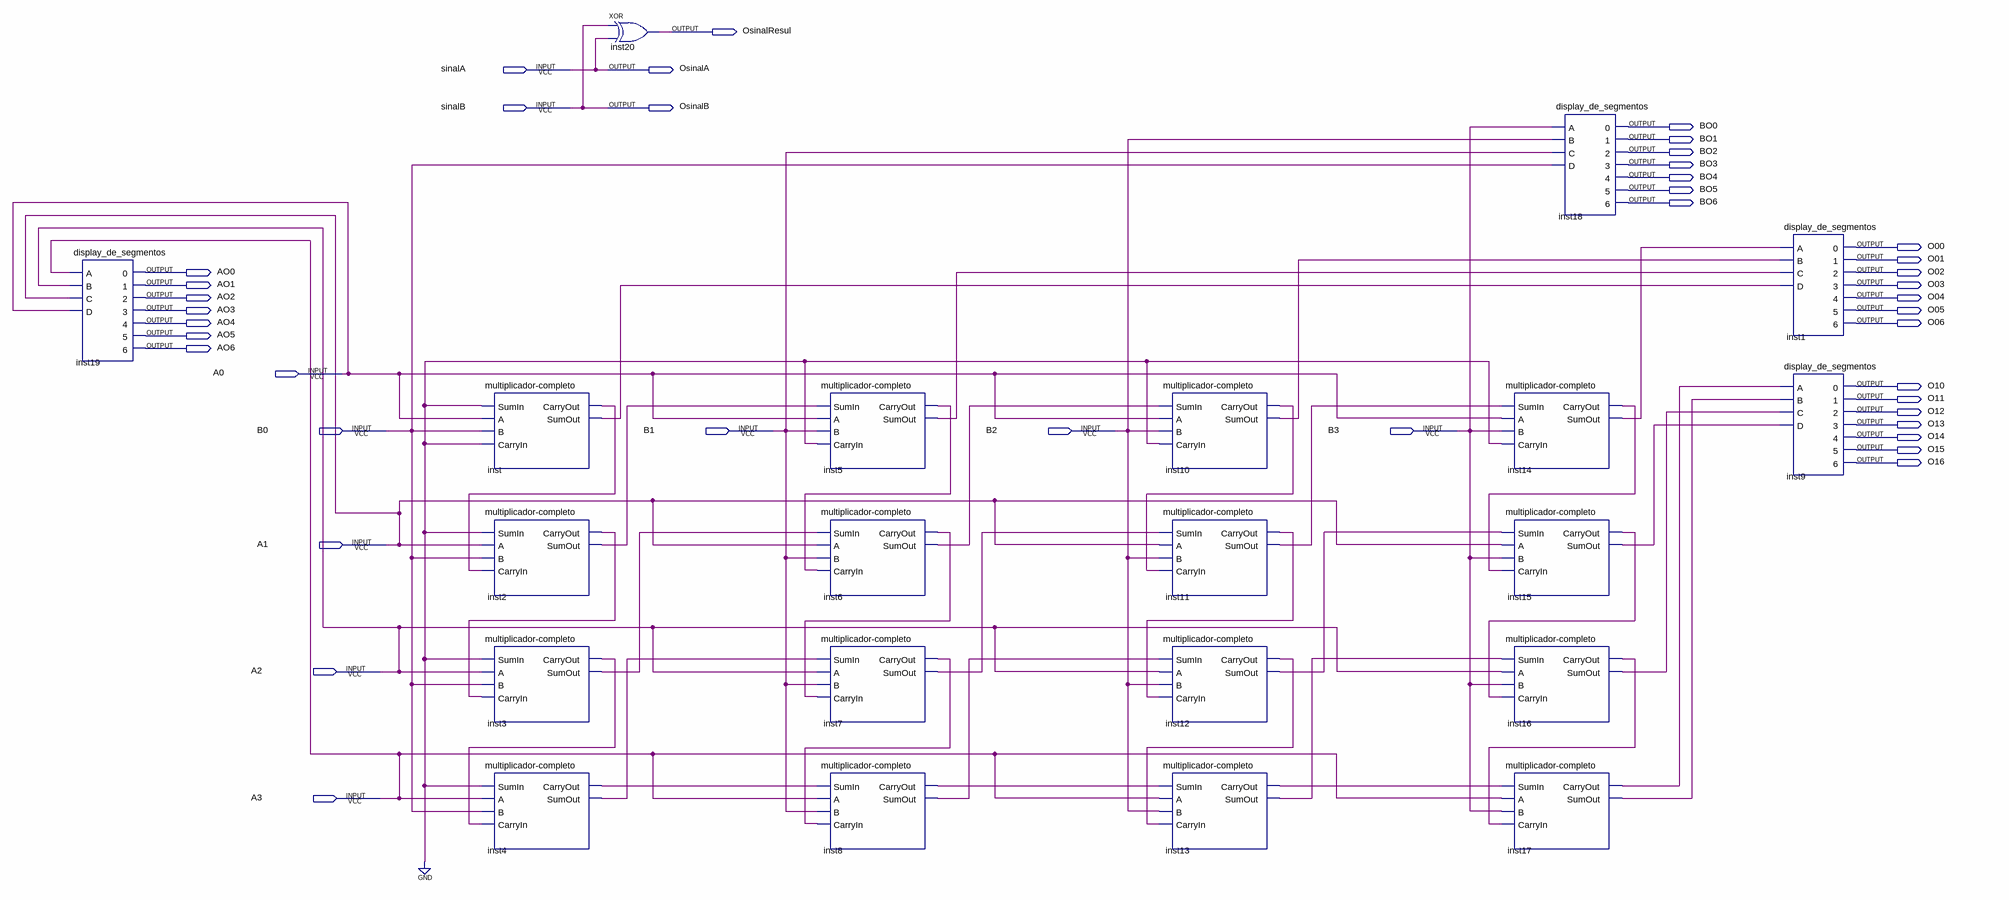
[diagram p0: schematic sheet]
// Quartus schematic multiplicador_4bits.bdf as structural Verilog: 21 symbols, 41 pins
module multiplicador_4bits (
  input  sinalA,
  input  sinalB,
  input  A0,
  input  B0,
  input  B1,
  input  B2,
  input  B3,
  input  A1,
  input  A2,
  input  A3,
  output OsinalResul,
  output OsinalA,
  output OsinalB,
  output BO0,
  output BO1,
  output BO2,
  output BO3,
  output BO4,
  output BO5,
  output BO6,
  output O00,
  output O01,
  output AO0,
  output O02,
  output AO1,
  output O03,
  output AO2,
  output O04,
  output AO3,
  output O05,
  output AO4,
  output O06,
  output AO5,
  output AO6,
  output O10,
  output O11,
  output O12,
  output O13,
  output O14,
  output O15,
  output O16
);

  wire inst2_carryout, inst2_sumout, inst3_carryout, inst3_sumout, inst4_carryout, inst4_sumout,
       inst5_carryout, inst5_sumout, inst6_carryout, inst6_sumout, inst7_carryout, inst7_sumout,
       inst8_carryout, inst8_sumout, inst10_carryout, inst10_sumout, inst11_carryout, inst11_sumout,
       inst12_carryout, inst12_sumout, inst13_carryout, inst13_sumout, inst14_carryout, inst14_sumout,
       inst15_carryout, inst15_sumout, inst16_carryout, inst16_sumout, inst17_carryout, inst17_sumout,
       inst_carryout, inst_sumout;

  display_de_segmentos inst19 (
    .A(A3), .B(A2), .C(A1), .D(A0), .\0 (AO0), .\1 (AO1), .\2 (AO2), .\3 (AO3), .\4 (AO4), .\5 (AO5),
    .\6 (AO6));
  \multiplicador-completo  inst (
    .SumIn(1'b0), .A(A0), .B(B0), .CarryIn(1'b0), .CarryOut(inst_carryout), .SumOut(inst_sumout));
  \multiplicador-completo  inst2 (
    .SumIn(1'b0), .A(A1), .B(B0), .CarryIn(inst_carryout), .CarryOut(inst2_carryout), .SumOut(inst2_sumout));
  \multiplicador-completo  inst3 (
    .SumIn(1'b0), .A(A2), .B(B0), .CarryIn(inst2_carryout), .CarryOut(inst3_carryout), .SumOut(inst3_sumout));
  \multiplicador-completo  inst4 (
    .SumIn(1'b0), .A(A3), .B(B0), .CarryIn(inst3_carryout), .CarryOut(inst4_carryout), .SumOut(inst4_sumout));
  xor inst20 (OsinalResul, sinalB, sinalA);
  \multiplicador-completo  inst5 (
    .SumIn(inst2_sumout), .A(A0), .B(B1), .CarryIn(1'b0), .CarryOut(inst5_carryout), .SumOut(inst5_sumout));
  \multiplicador-completo  inst6 (
    .SumIn(inst3_sumout), .A(A1), .B(B1), .CarryIn(inst5_carryout), .CarryOut(inst6_carryout),
    .SumOut(inst6_sumout));
  \multiplicador-completo  inst7 (
    .SumIn(inst4_sumout), .A(A2), .B(B1), .CarryIn(inst6_carryout), .CarryOut(inst7_carryout),
    .SumOut(inst7_sumout));
  \multiplicador-completo  inst8 (
    .SumIn(inst4_carryout), .A(A3), .B(B1), .CarryIn(inst7_carryout), .CarryOut(inst8_carryout),
    .SumOut(inst8_sumout));
  \multiplicador-completo  inst10 (
    .SumIn(inst6_sumout), .A(A0), .B(B2), .CarryIn(1'b0), .CarryOut(inst10_carryout), .SumOut(inst10_sumout));
  \multiplicador-completo  inst11 (
    .SumIn(inst7_sumout), .A(A1), .B(B2), .CarryIn(inst10_carryout), .CarryOut(inst11_carryout),
    .SumOut(inst11_sumout));
  \multiplicador-completo  inst12 (
    .SumIn(inst8_sumout), .A(A2), .B(B2), .CarryIn(inst11_carryout), .CarryOut(inst12_carryout),
    .SumOut(inst12_sumout));
  \multiplicador-completo  inst13 (
    .SumIn(inst8_carryout), .A(A3), .B(B2), .CarryIn(inst12_carryout), .CarryOut(inst13_carryout),
    .SumOut(inst13_sumout));
  \multiplicador-completo  inst14 (
    .SumIn(inst11_sumout), .A(A0), .B(B3), .CarryIn(1'b0), .CarryOut(inst14_carryout), .SumOut(inst14_sumout));
  \multiplicador-completo  inst15 (
    .SumIn(inst12_sumout), .A(A1), .B(B3), .CarryIn(inst14_carryout), .CarryOut(inst15_carryout),
    .SumOut(inst15_sumout));
  \multiplicador-completo  inst16 (
    .SumIn(inst13_sumout), .A(A2), .B(B3), .CarryIn(inst15_carryout), .CarryOut(inst16_carryout),
    .SumOut(inst16_sumout));
  \multiplicador-completo  inst17 (
    .SumIn(inst13_carryout), .A(A3), .B(B3), .CarryIn(inst16_carryout), .CarryOut(inst17_carryout),
    .SumOut(inst17_sumout));
  display_de_segmentos inst18 (
    .A(B3), .B(B2), .C(B1), .D(B0), .\0 (BO0), .\1 (BO1), .\2 (BO2), .\3 (BO3), .\4 (BO4), .\5 (BO5),
    .\6 (BO6));
  display_de_segmentos inst1 (
    .A(inst14_sumout), .B(inst10_sumout), .C(inst5_sumout), .D(inst_sumout), .\0 (O00), .\1 (O01), .\2 (O02),
    .\3 (O03), .\4 (O04), .\5 (O05), .\6 (O06));
  display_de_segmentos inst9 (
    .A(inst17_carryout), .B(inst17_sumout), .C(inst16_sumout), .D(inst15_sumout), .\0 (O10), .\1 (O11),
    .\2 (O12), .\3 (O13), .\4 (O14), .\5 (O15), .\6 (O16));

  assign OsinalA = sinalA;
  assign OsinalB = sinalB;
endmodule
